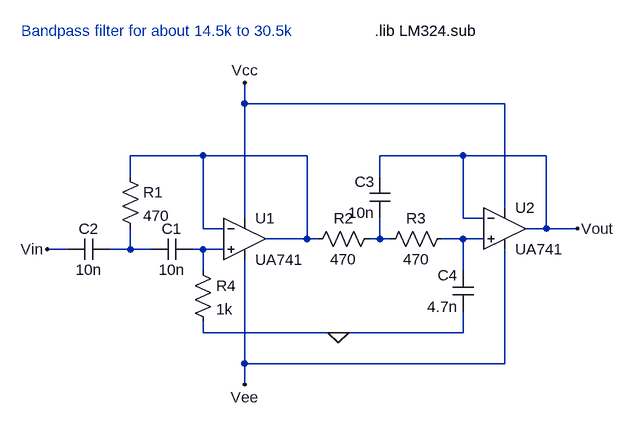
[diagram p0: schematic BandPass2.asc]
BandPass2.asc, the LTspice schematic file:
Version 4
SHEET 1 880 680
WIRE 96 -64 96 -96
WIRE 496 -64 96 -64
WIRE 32 16 -80 16
WIRE 192 16 32 16
WIRE 432 16 304 16
WIRE 560 16 432 16
WIRE -80 48 -80 16
WIRE 304 48 304 16
WIRE 496 96 496 -64
WIRE 96 112 96 -64
WIRE 432 112 432 16
WIRE 464 112 432 112
WIRE 32 128 32 16
WIRE 64 128 32 128
WIRE 560 128 560 16
WIRE 560 128 528 128
WIRE 608 128 560 128
WIRE 192 144 192 16
WIRE 192 144 128 144
WIRE 208 144 192 144
WIRE 304 144 304 112
WIRE 304 144 288 144
WIRE 320 144 304 144
WIRE 432 144 400 144
WIRE 464 144 432 144
WIRE -176 160 -208 160
WIRE -80 160 -80 128
WIRE -80 160 -112 160
WIRE -48 160 -80 160
WIRE 32 160 16 160
WIRE 64 160 32 160
WIRE 32 192 32 160
WIRE 432 192 432 144
WIRE 32 288 32 272
WIRE 240 288 32 288
WIRE 432 288 432 256
WIRE 432 288 240 288
WIRE 96 336 96 176
WIRE 496 336 496 160
WIRE 496 336 96 336
WIRE 96 368 96 336
FLAG 240 288 0
FLAG -208 160 Vin
FLAG 608 128 Vout
FLAG 96 -96 Vcc
FLAG 96 368 Vee
SYMBOL cap 16 144 R90
WINDOW 0 0 32 VBottom 2
WINDOW 3 32 32 VTop 2
SYMATTR InstName C1
SYMATTR Value 10n
SYMBOL cap -112 144 R90
WINDOW 0 0 32 VBottom 2
WINDOW 3 32 32 VTop 2
SYMATTR InstName C2
SYMATTR Value 10n
SYMBOL res -96 32 R0
SYMATTR InstName R1
SYMATTR Value 470
SYMBOL res 304 128 R90
WINDOW 0 0 56 VBottom 2
WINDOW 3 32 56 VTop 2
SYMATTR InstName R2
SYMATTR Value 470
SYMBOL res 416 128 R90
WINDOW 0 0 56 VBottom 2
WINDOW 3 32 56 VTop 2
SYMATTR InstName R3
SYMATTR Value 470
SYMBOL cap 320 112 R180
WINDOW 0 24 56 Left 2
WINDOW 3 24 8 Left 2
SYMATTR InstName C3
SYMATTR Value 10n
SYMBOL cap 448 256 R180
WINDOW 0 24 56 Left 2
WINDOW 3 24 8 Left 2
SYMATTR InstName C4
SYMATTR Value 4.7n
SYMBOL res 16 176 R0
SYMATTR InstName R4
SYMATTR Value 1k
SYMBOL Opamps\\LM324 96 80 R0
SYMATTR InstName U1
SYMATTR Value UA741
SYMBOL Opamps\\LM324 496 64 R0
SYMATTR InstName U2
SYMATTR Value UA741
TEXT -248 -176 Left 2 ;Bandpass filter for about 14.5k to 30.5k
TEXT 296 -176 Left 2 !.lib LM324.sub

The netlist it stands for:
* BandPass2.asc
C1 N005 N004 10n
C2 N004 Vin 10n
R1 N001 N004 470
R2 N002 N001 470
R3 N003 N002 470
C3 N002 Vout 10n
C4 0 N003 4.7n
R4 N005 0 1k
XU1 N005 N001 Vcc Vee N001 UA741  ; pins In+ In- V+ V- OUT
XU2 N003 Vout Vcc Vee Vout UA741  ; pins In+ In- V+ V- OUT
* Bandpass filter for about 14.5k to 30.5k
.lib LM324.sub
.backanno
.end